# Altium schematic sheet LD1117AS33TR.SchDoc
size A4
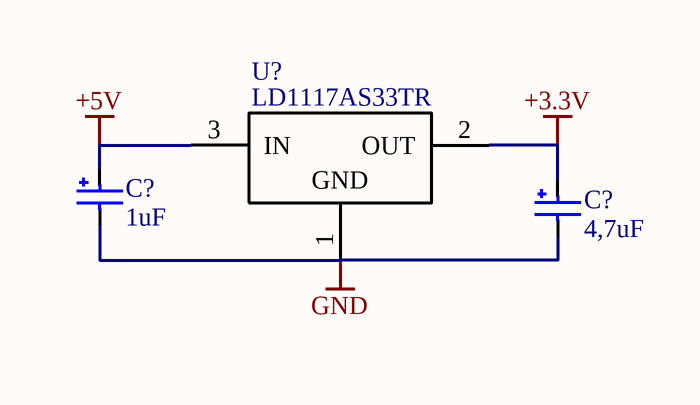
[diagram p0: LD1117AS33TR.SchDoc]

## Parts
(Parts that share a designator on the sheet are numbered #1, #2 ... from top to bottom, then left to right.)
C?#1  1uF  [5x11]
C?#2  4,7uF  [5x11]
U?  LD1117AS33TR  [SOT-223_N]

## Nets
+3.3V: C?#2.1 U?.2(OUT)
+5V: C?#1.1 U?.3(IN)
GND: C?#1.2 C?#2.2 U?.1(GND)

## Library data of the parts
C?#1 C?#2 = Capacitor Polar
U? = LD1117AS33TR: Voltage Regulators 800mA